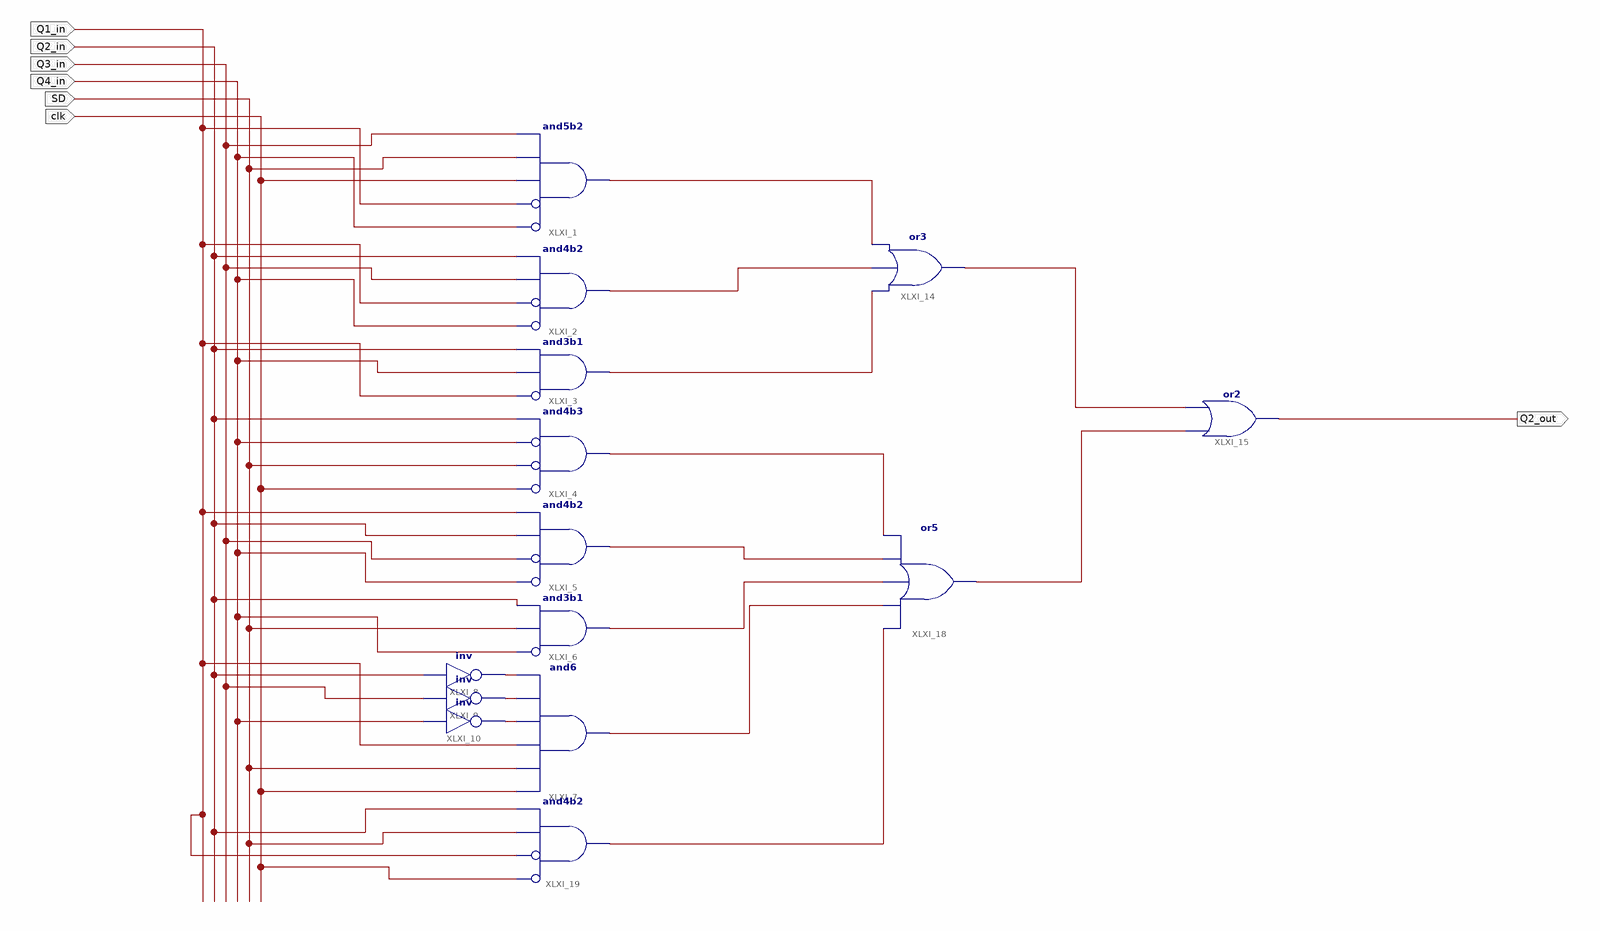
[diagram p0: schematic sheet 1]
// Xilinx ISE schematic Q2_schematic.sch (spartan6) as structural Verilog: 14 symbols, 7 ports
module Q2_schematic (
  input  Q1_in,
  input  Q2_in,
  input  Q3_in,
  input  Q4_in,
  input  SD,
  input  clk,
  output Q2_out
);

  wire XLXN_1, XLXN_2, XLXN_3, XLXN_12, XLXN_13, XLXN_14, XLXN_19, XLXN_20, XLXN_21, XLXN_22, XLXN_23,
       XLXN_25, XLXN_26;

  and XLXI_1 (XLXN_12, ~Q4_in, ~Q1_in, clk, SD, Q3_in);  // and5b2
  and XLXI_2 (XLXN_13, ~Q4_in, ~Q1_in, Q3_in, Q2_in);  // and4b2
  and XLXI_3 (XLXN_14, ~Q1_in, Q4_in, Q2_in);  // and3b1
  and XLXI_4 (XLXN_21, ~clk, ~SD, ~Q4_in, Q2_in);  // and4b3
  and XLXI_5 (XLXN_22, ~Q4_in, ~Q3_in, Q2_in, Q1_in);  // and4b2
  and XLXI_7 (XLXN_25, clk, SD, Q1_in, XLXN_3, XLXN_2, XLXN_1);
  not XLXI_8 (XLXN_1, Q2_in);
  not XLXI_9 (XLXN_2, Q3_in);
  not XLXI_10 (XLXN_3, Q4_in);
  and XLXI_6 (XLXN_23, ~Q4_in, SD, Q2_in);  // and3b1
  or XLXI_14 (XLXN_19, XLXN_14, XLXN_13, XLXN_12);
  or XLXI_15 (Q2_out, XLXN_20, XLXN_19);
  or XLXI_18 (XLXN_20, XLXN_26, XLXN_25, XLXN_23, XLXN_22, XLXN_21);
  and XLXI_19 (XLXN_26, ~clk, ~Q1_in, SD, Q2_in);  // and4b2
endmodule
